# EAGLE design Platine (EAGLE 5.11)
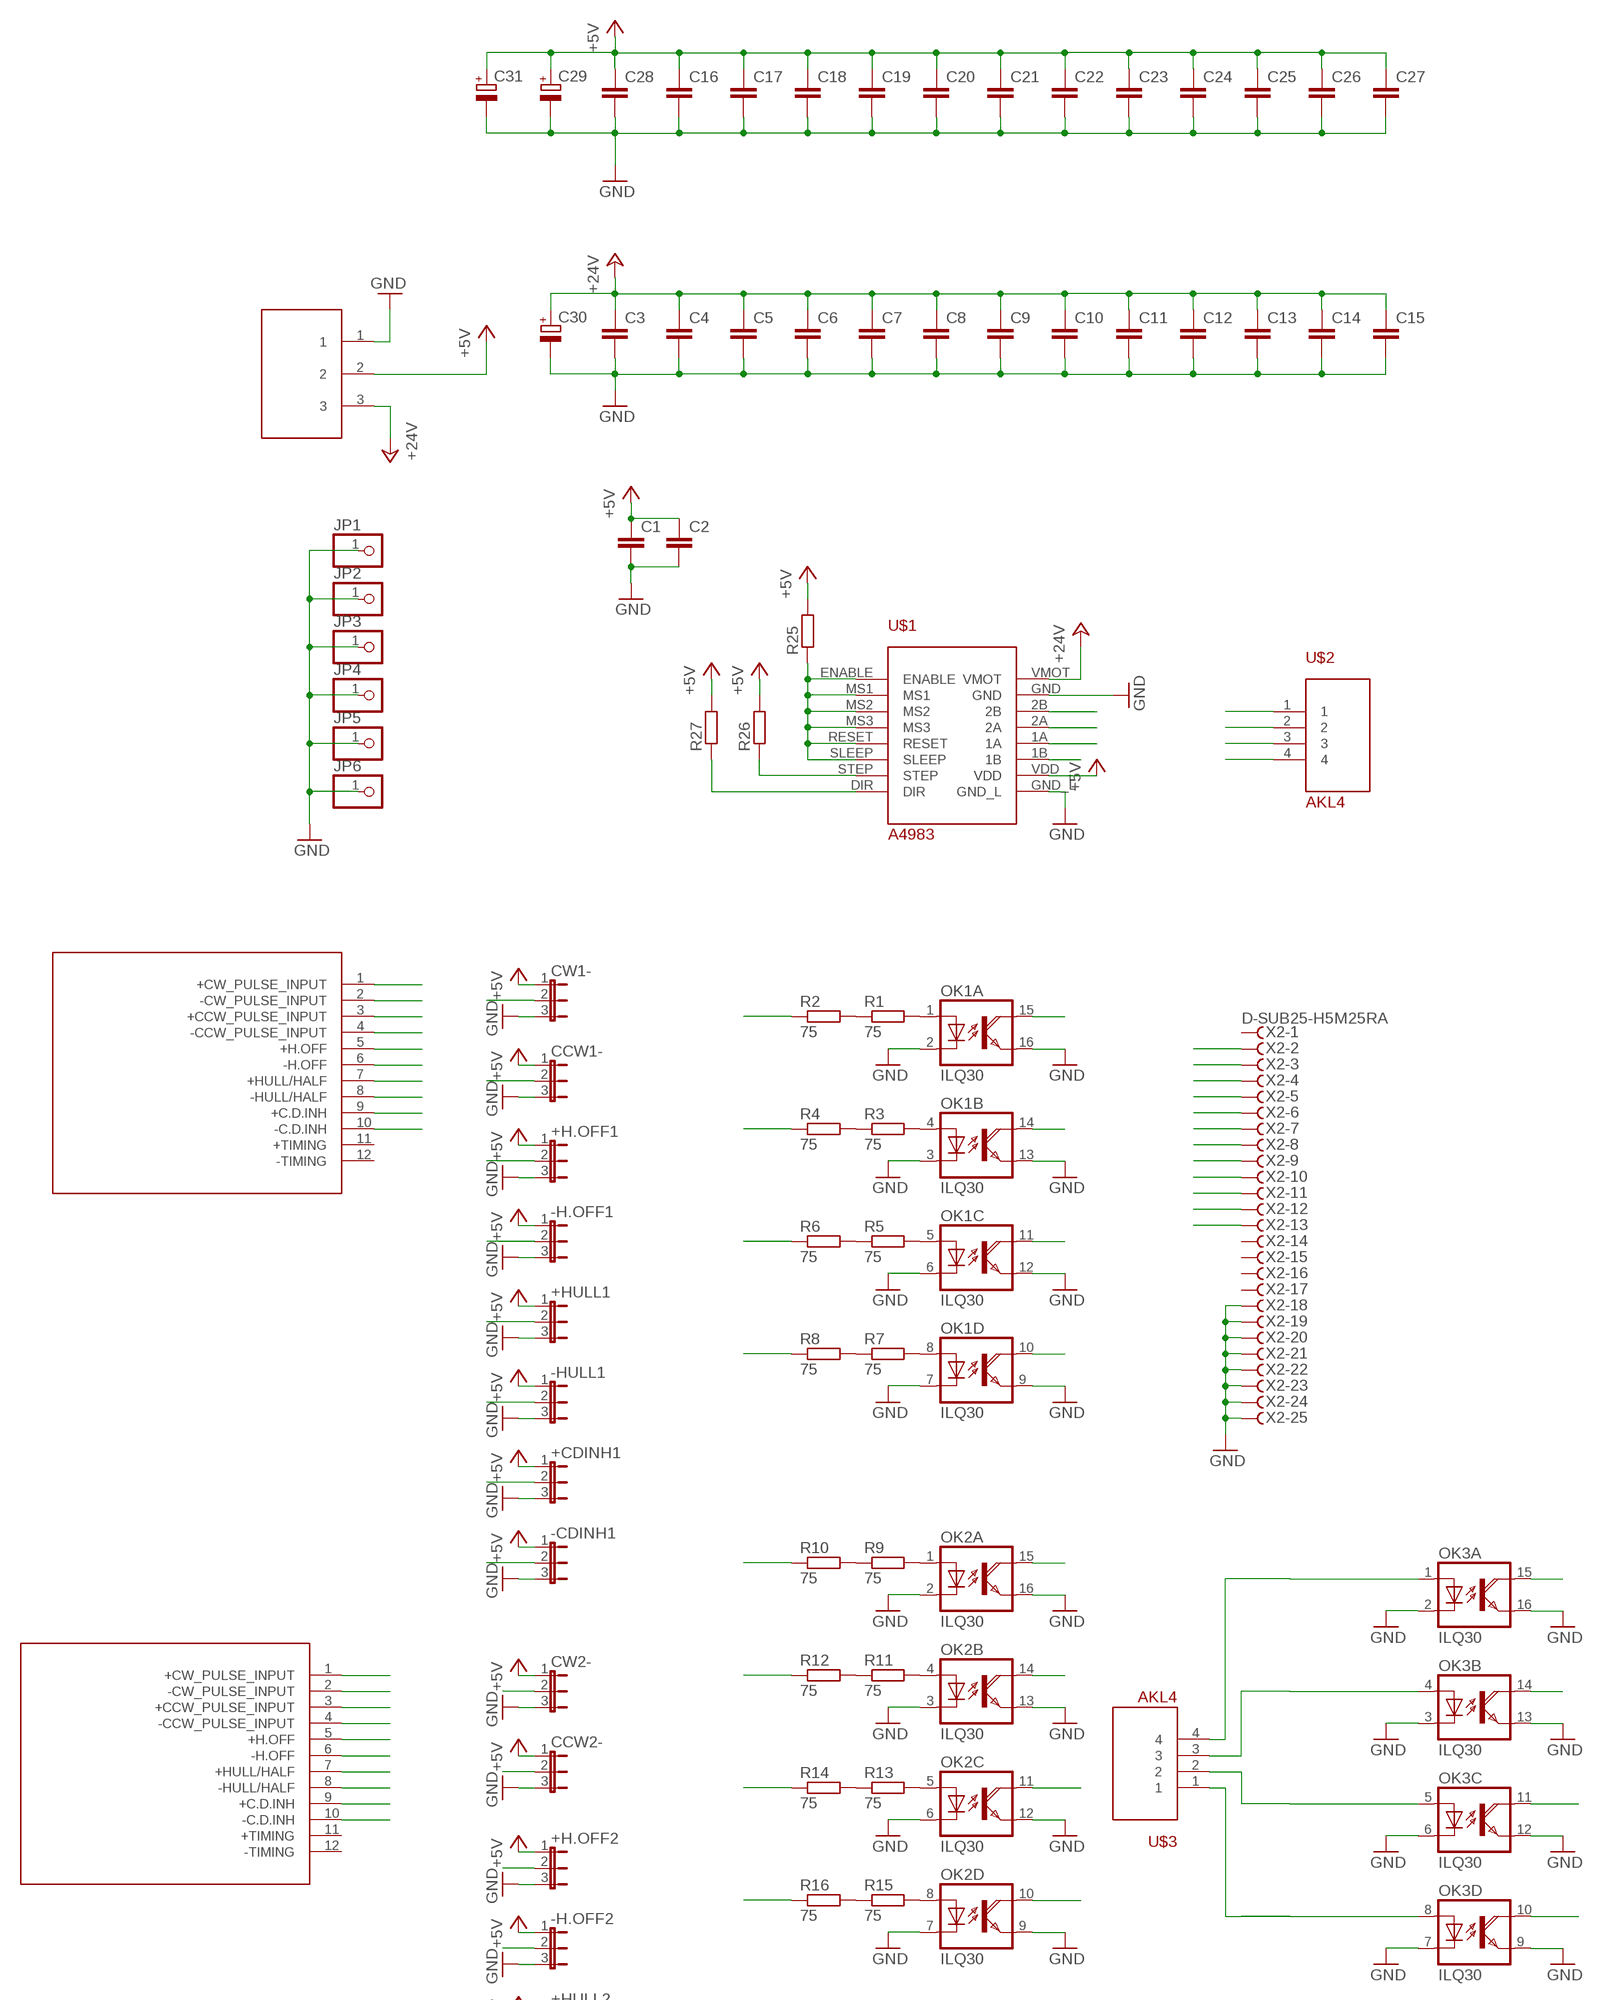
[diagram p0: schematic, sheet 1, part 1 of 2]
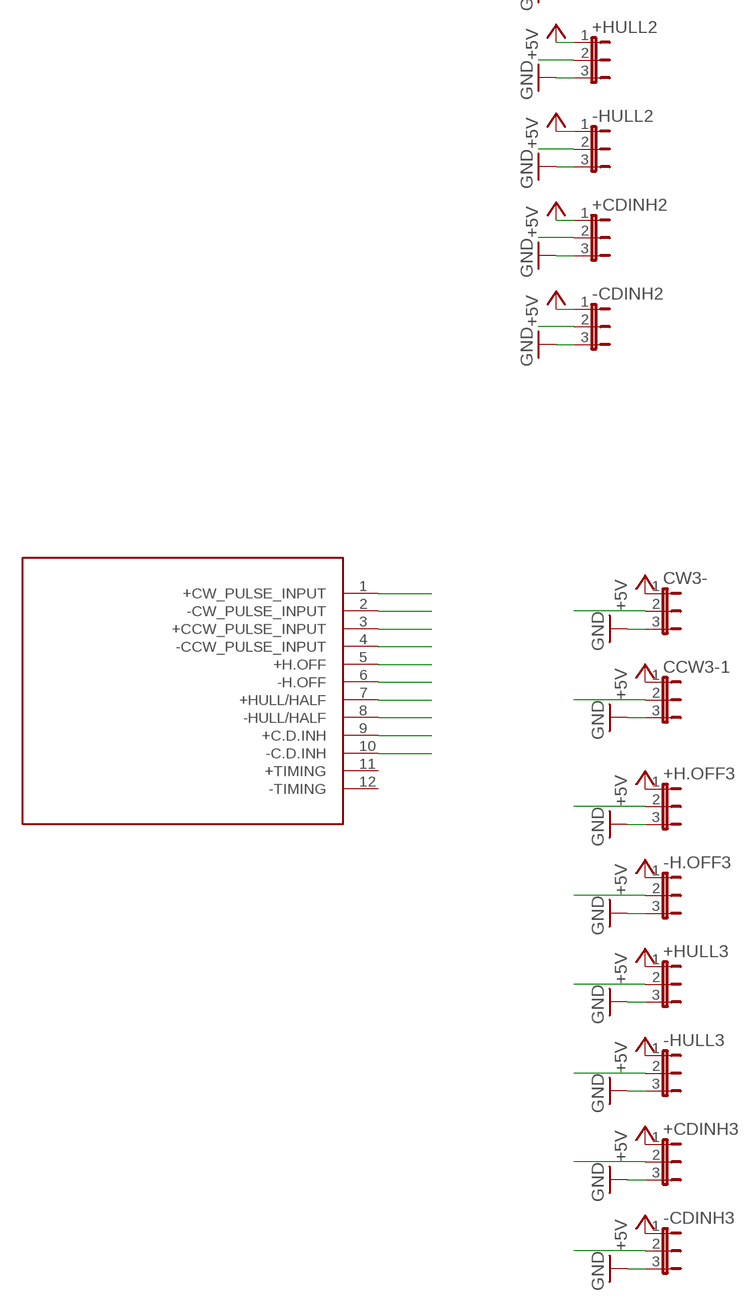
[diagram p1: schematic, sheet 1, part 2 of 2]

## Parts
+CDINH1  JP2E  [JP2]
+CDINH2  JP2E  [JP2]
+CDINH3  JP2E  [JP2]
+H.OFF1  JP2E  [JP2]
+H.OFF2  JP2E  [JP2]
+H.OFF3  JP2E  [JP2]
+HULL1  JP2E  [JP2]
+HULL2  JP2E  [JP2]
+HULL3  JP2E  [JP2]
-CDINH1  JP2E  [JP2]
-CDINH2  JP2E  [JP2]
-CDINH3  JP2E  [JP2]
-H.OFF1  JP2E  [JP2]
-H.OFF2  JP2E  [JP2]
-H.OFF3  JP2E  [JP2]
-HULL1  JP2E  [JP2]
-HULL2  JP2E  [JP2]
-HULL3  JP2E  [JP2]
C1  C-EUC1210  [C1210]
C2  C-EUC1210  [C1210]
C3  C-EUC1210  [C1210]
C4  C-EUC1210  [C1210]
C5  C-EUC1210  [C1210]
C6  C-EUC1210  [C1210]
C7  C-EUC1210  [C1210]
C8  C-EUC1210  [C1210]
C9  C-EUC1210  [C1210]
C10  C-EUC1210  [C1210]
C11  C-EUC1210  [C1210]
C12  C-EUC1210  [C1210]
C13  C-EUC1210  [C1210]
C14  C-EUC1210  [C1210]
C15  C-EUC1210  [C1210]
C16  C-EUC1210  [C1210]
C17  C-EUC1210  [C1210]
C18  C-EUC1210  [C1210]
C19  C-EUC1210  [C1210]
C20  C-EUC1210  [C1210]
C21  C-EUC1210  [C1210]
C22  C-EUC1210  [C1210]
C23  C-EUC1210  [C1210]
C24  C-EUC1210  [C1210]
C25  C-EUC1210  [C1210]
C26  C-EUC1210  [C1210]
C27  C-EUC1210  [C1210]
C28  C-EUC1210  [C1210]
C29  CPOL-EUE5-13  [E5-13]
C30  CPOL-EUE5-13  [E5-13]
C31  CPOL-EUE5-13  [E5-13]
CCW1-  JP2E  [JP2]
CCW2-  JP2E  [JP2]
CCW3-1  JP2E  [JP2]
CW1-  JP2E  [JP2]
CW2-  JP2E  [JP2]
CW3-  JP2E  [JP2]
JP1  PINHD-1X1  [1X01]
JP2  PINHD-1X1  [1X01]
JP3  PINHD-1X1  [1X01]
JP4  PINHD-1X1  [1X01]
JP5  PINHD-1X1  [1X01]
JP6  PINHD-1X1  [1X01]
MOTORTREIBER1  STEPPERCONTROLER  [CONTROLER]
MOTORTREIBER2  STEPPERCONTROLER  [CONTROLER]
MOTORTREIBER3  STEPPERCONTROLER  [CONTROLER]
OK1  ILQ30  [DIL16]
OK2  ILQ30  [DIL16]
OK3  ILQ30  [DIL16]
R1  75  R-EU_MELF0204W  [MINI_MELF-0204W]
R2  75  R-EU_MELF0204W  [MINI_MELF-0204W]
R3  75  R-EU_MELF0204W  [MINI_MELF-0204W]
R4  75  R-EU_MELF0204W  [MINI_MELF-0204W]
R5  75  R-EU_MELF0204W  [MINI_MELF-0204W]
R6  75  R-EU_MELF0204W  [MINI_MELF-0204W]
R7  75  R-EU_MELF0204W  [MINI_MELF-0204W]
R8  75  R-EU_MELF0204W  [MINI_MELF-0204W]
R9  75  R-EU_MELF0204W  [MINI_MELF-0204W]
R10  75  R-EU_MELF0204W  [MINI_MELF-0204W]
R11  75  R-EU_MELF0204W  [MINI_MELF-0204W]
R12  75  R-EU_MELF0204W  [MINI_MELF-0204W]
R13  75  R-EU_MELF0204W  [MINI_MELF-0204W]
R14  75  R-EU_MELF0204W  [MINI_MELF-0204W]
R15  75  R-EU_MELF0204W  [MINI_MELF-0204W]
R16  75  R-EU_MELF0204W  [MINI_MELF-0204W]
R25  R-EU_R0805  [R0805]
R26  R-EU_R0805  [R0805]
R27  R-EU_R0805  [R0805]
U$1  A4983  [A4983]
U$2  AKL4  AKL45.08  [AKL5.08]
U$3  AKL4  AKL45.08  [AKL5.08]
U$4  AKL35.08  [AKL3-5.08]
X2  D-SUB25-H5M25RA  [H5M25RA]

## Nets
+5V: +CDINH1.1 +CDINH2.1 +CDINH3.1 +H.OFF1.1 +H.OFF2.1 +H.OFF3.1 +HULL1.1 +HULL2.1 +HULL3.1 -CDINH1.1 -CDINH2.1 -CDINH3.1 -H.OFF1.1 -H.OFF2.1 -H.OFF3.1 -HULL1.1 -HULL2.1 -HULL3.1 C1.1 C2.1 C16.1 C17.1 C18.1 C19.1 C20.1 C21.1 C22.1 C23.1 C24.1 C25.1 C26.1 C27.1 C28.1 C29.+ C31.+ CCW1-.1 CCW2-.1 CCW3-1.1 CW1-.1 CW2-.1 CW3-.1 R25.2 R26.2 R27.2 U$1.VDD U$4.2
+24V: C3.1 C4.1 C5.1 C6.1 C7.1 C8.1 C9.1 C10.1 C11.1 C12.1 C13.1 C14.1 C15.1 C30.+ U$1.VMOT U$4.3
+CDINH1: +CDINH1.2 MOTORTREIBER1.9(+C.D.INH)
+CDINH2: +CDINH2.2 MOTORTREIBER2.9(+C.D.INH)
+CDINH3: +CDINH3.2 MOTORTREIBER3.9(+C.D.INH)
+H.OFF1: +H.OFF1.2 MOTORTREIBER1.5(+H.OFF)
+H.OFF2: +H.OFF2.2 MOTORTREIBER2.5(+H.OFF)
+H.OFF3: +H.OFF3.2 MOTORTREIBER3.5(+H.OFF)
+HULL1: +HULL1.2 MOTORTREIBER1.7(+HULL/HALF)
+HULL2: +HULL2.2 MOTORTREIBER2.7(+HULL/HALF)
+HULL3: +HULL3.2 MOTORTREIBER3.7(+HULL/HALF)
-CDINH1: -CDINH1.2 MOTORTREIBER1.10(-C.D.INH)
-CDINH2: -CDINH2.2 MOTORTREIBER2.10(-C.D.INH)
-CDINH3: -CDINH3.2 MOTORTREIBER3.10(-C.D.INH)
-H.OFF1: -H.OFF1.2 MOTORTREIBER1.6(-H.OFF)
-H.OFF2: -H.OFF2.2 MOTORTREIBER2.6(-H.OFF)
-H.OFF3: -H.OFF3.2 MOTORTREIBER3.6(-H.OFF)
-HULL1: -HULL1.2 MOTORTREIBER1.8(-HULL/HALF)
-HULL2: -HULL2.2 MOTORTREIBER2.8(-HULL/HALF)
-HULL3: -HULL3.2 MOTORTREIBER3.8(-HULL/HALF)
CCW1: MOTORTREIBER1.3(+CCW_PULSE_INPUT) OK1.11(C:COL)
CCW1-: CCW1-.2 MOTORTREIBER1.4(-CCW_PULSE_INPUT)
CCW2: MOTORTREIBER2.3(+CCW_PULSE_INPUT) OK1.15(A:COL)
CCW2-: CCW2-.2 MOTORTREIBER2.4(-CCW_PULSE_INPUT)
CCW3: MOTORTREIBER3.3(+CCW_PULSE_INPUT) OK2.11(C:COL)
CCW3-: CCW3-1.2 MOTORTREIBER3.4(-CCW_PULSE_INPUT)
CW1: MOTORTREIBER1.1(+CW_PULSE_INPUT) OK1.10(D:COL)
CW1-: CW1-.2 MOTORTREIBER1.2(-CW_PULSE_INPUT)
CW2: MOTORTREIBER2.1(+CW_PULSE_INPUT) OK1.14(B:COL)
CW2-: CW2-.2 MOTORTREIBER2.2(-CW_PULSE_INPUT)
CW3: MOTORTREIBER3.1(+CW_PULSE_INPUT) OK2.10(D:COL)
CW3-: CW3-.2 MOTORTREIBER3.2(-CW_PULSE_INPUT)
DIR: OK2.14(B:COL) R27.1 U$1.DIR
GNDLAPTOP: OK1.2(A:C) OK1.3(B:C) OK1.6(C:C) OK1.7(D:C) OK2.2(A:C) OK2.3(B:C) OK2.6(C:C) OK2.7(D:C) OK3.9(D:EMI) OK3.12(C:EMI) OK3.13(B:EMI) OK3.16(A:EMI) X2.18 X2.19 X2.20 X2.21 X2.22 X2.23 X2.24 X2.25 ; supply symbol labelled GND
GNDROBOTER: +CDINH1.3 +CDINH2.3 +CDINH3.3 +H.OFF1.3 +H.OFF2.3 +H.OFF3.3 +HULL1.3 +HULL2.3 +HULL3.3 -CDINH1.3 -CDINH2.3 -CDINH3.3 -H.OFF1.3 -H.OFF2.3 -H.OFF3.3 -HULL1.3 -HULL2.3 -HULL3.3 C1.2 C2.2 C3.2 C4.2 C5.2 C6.2 C7.2 C8.2 C9.2 C10.2 C11.2 C12.2 C13.2 C14.2 C15.2 C16.2 C17.2 C18.2 C19.2 C20.2 C21.2 C22.2 C23.2 C24.2 C25.2 C26.2 C27.2 C28.2 C29.- C30.- C31.- CCW1-.3 CCW2-.3 CCW3-1.3 CW1-.3 CW2-.3 CW3-.3 JP1.1 JP2.1 JP3.1 JP4.1 JP5.1 JP6.1 OK1.9(D:EMI) OK1.12(C:EMI) OK1.13(B:EMI) OK1.16(A:EMI) OK2.9(D:EMI) OK2.12(C:EMI) OK2.13(B:EMI) OK2.16(A:EMI) OK3.2(A:C) OK3.3(B:C) OK3.6(C:C) OK3.7(D:C) U$1.GND U$1.GND_L U$4.1 ; supply symbol labelled GND
IN1: OK3.1(A:A) U$3.4
IN2: OK3.4(B:A) U$3.3
IN3: OK3.5(C:A) U$3.2
INL1: OK3.15(A:COL) X2.13
INL2: OK3.14(B:COL) X2.12
INL3: OK3.11(C:COL) X2.11
INL4: OK3.10(D:COL) X2.10
MOTOR1A: U$1.1A U$2.3
MOTOR1B: U$1.1B U$2.4
MOTOR2A: U$1.2A U$2.2
MOTOR2B: U$1.2B U$2.1
N$1: OK1.1(A:A) R1.2
N$2: R3.1 R4.2
N$3: OK1.4(B:A) R3.2
N$4: R5.1 R6.2
N$5: R1.1 R2.2
N$6: OK1.5(C:A) R5.2
N$7: OK1.8(D:A) R7.2
N$8: R7.1 R8.2
N$9: OK2.1(A:A) R9.2
N$10: R9.1 R10.2
N$11: R11.1 R12.2
N$12: R13.1 R14.2
N$13: R15.1 R16.2
N$14: OK2.4(B:A) R11.2
N$15: OK2.5(C:A) R13.2
N$16: OK2.8(D:A) R15.2
N$18: OK3.8(D:A) U$3.1
N$25: R25.1 U$1.ENABLE U$1.MS1 U$1.MS2 U$1.MS3 U$1.RESET U$1.SLEEP
OUT1: R2.1 X2.2
OUT2: R4.1 X2.3
OUT3: R6.1 X2.4
OUT4: R8.1 X2.5
OUT5: R10.1 X2.6
OUT6: R12.1 X2.7
OUT7: R14.1 X2.8
OUT8: R16.1 X2.9
STEP: OK2.15(A:COL) R26.1 U$1.STEP
Unconnected: MOTORTREIBER1.11(+TIMING) MOTORTREIBER1.12(-TIMING) MOTORTREIBER2.11(+TIMING) MOTORTREIBER2.12(-TIMING) MOTORTREIBER3.11(+TIMING) MOTORTREIBER3.12(-TIMING) X2.1 X2.14 X2.15 X2.16 X2.17

## Library data of the parts
+CDINH1-+CDINH3 +H.OFF1-+H.OFF3 +HULL1-+HULL3 -CDINH1--CDINH3 -H.OFF1--H.OFF3 -HULL1--HULL3 CCW1- CCW2- CCW3-1 CW1- CW2- CW3- = jumper:JP2E: JUMPER
C1-C28 = rcl:C-EU: CAPACITOR, European symbol
C29-C31 = rcl:CPOL-EU: POLARIZED CAPACITOR, European symbol
JP1-JP6 = pinhead:PINHD-1X1: PIN HEADER
MOTORTREIBER1-MOTORTREIBER3 = steppercontroler C5D5814N-P:STEPPERCONTROLER
OK1-OK3 = optocoupler:ILQ30: SIEMENS OPTO COUPLER; MF: VISHAY/TELEFUNKEN; MPN: ILQ30; OC_FARNELL: 1612449; OC_NEWARK: 58K1688
R1-R16 R25-R27 = rcl:R-EU_: RESISTOR, European symbol
U$1 = A4983:A4983
U$2 U$3 = anschlussklemmen:AKL4
U$4 = anschlussklemmen:AKL3
X2 = con-thomas-betts-smallholes:D-SUB25-: D-Subminiatur Connector Source: Electronioc Interconnects European Edition 1998; MPN: H5M25RA29CS; OC_FARNELL: unknown; OC_NEWARK: 93F8324

## Board
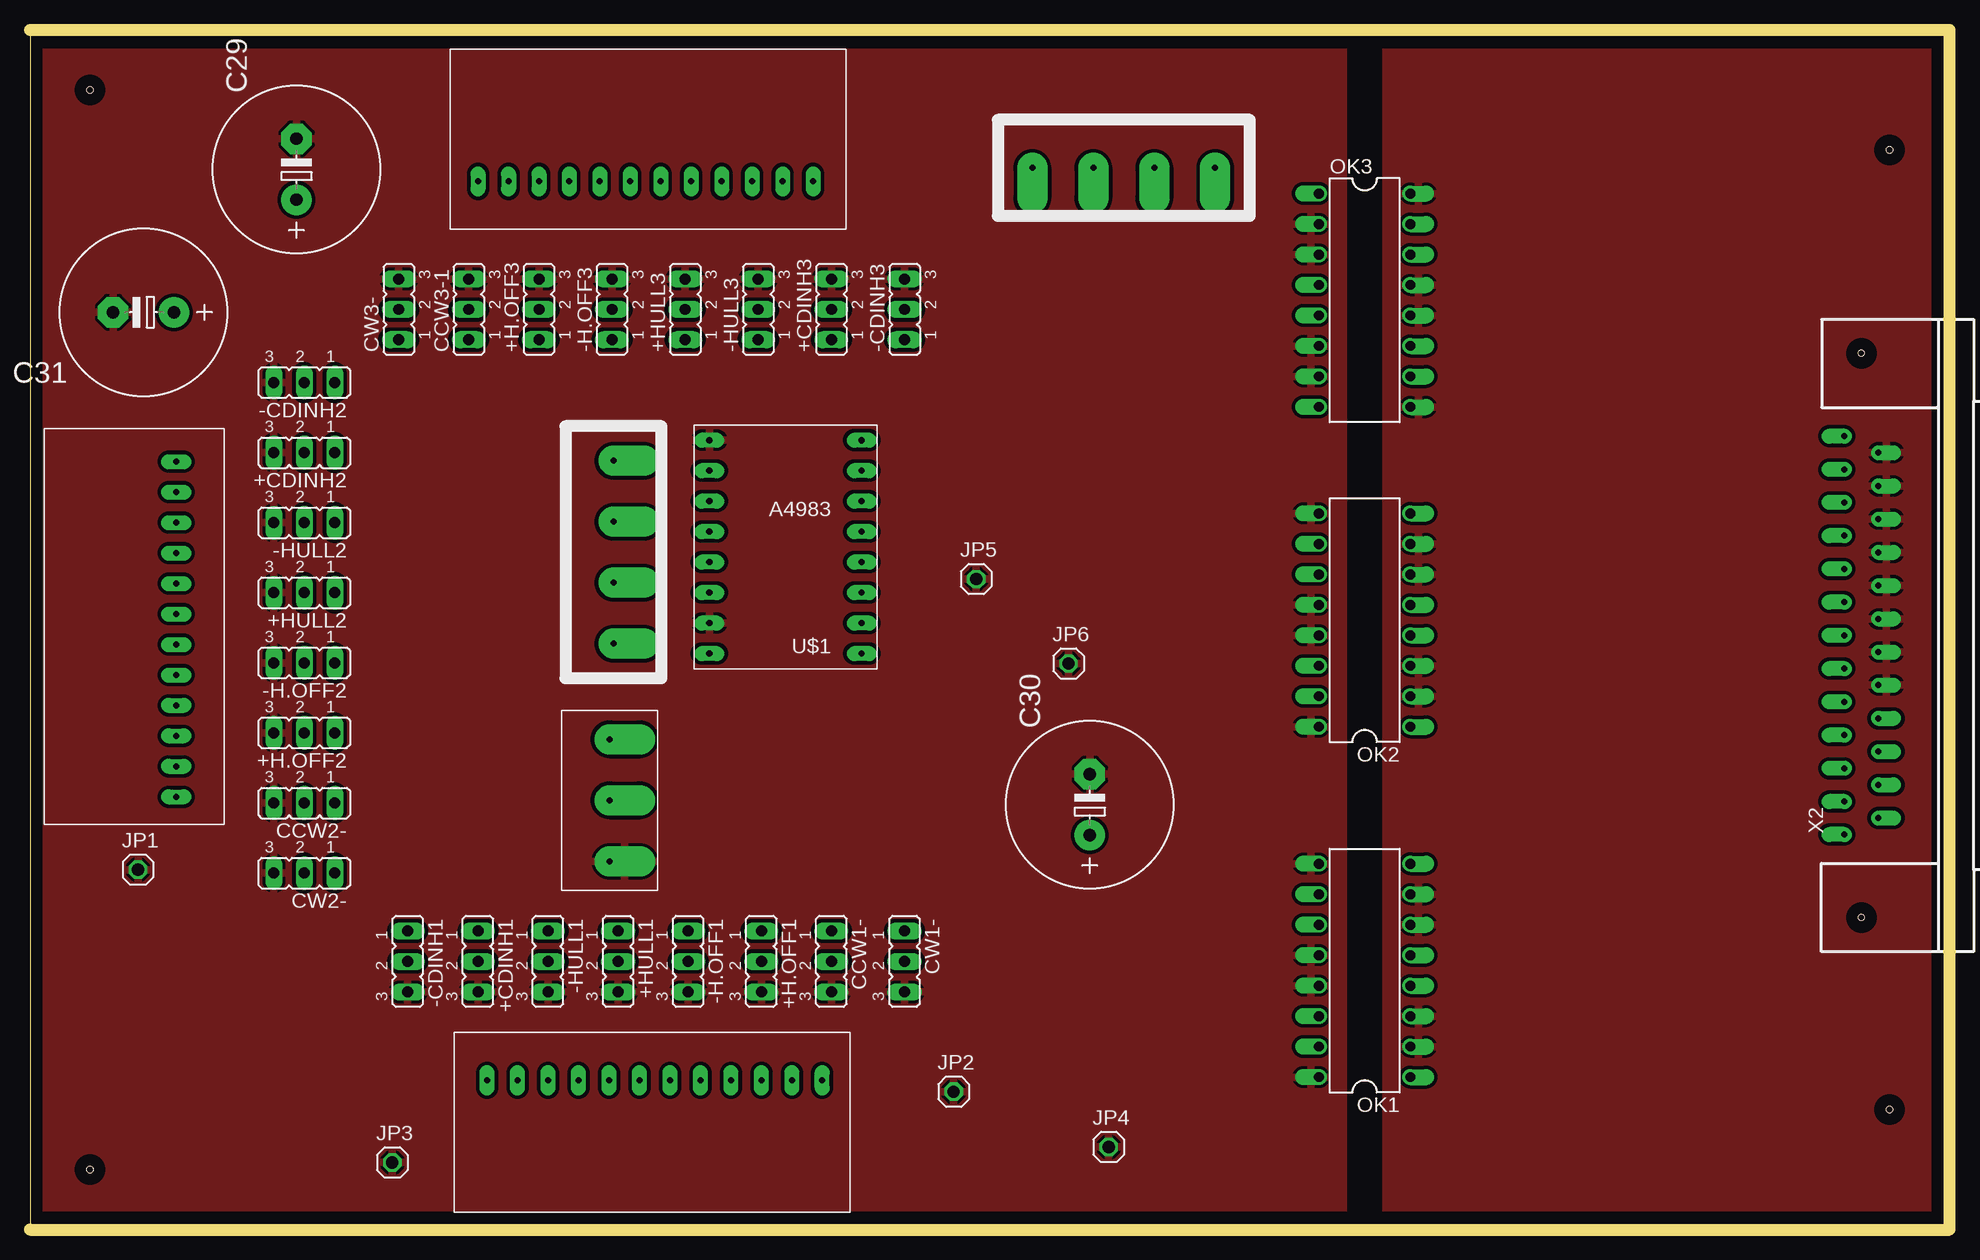
[diagram p2: board, top side]
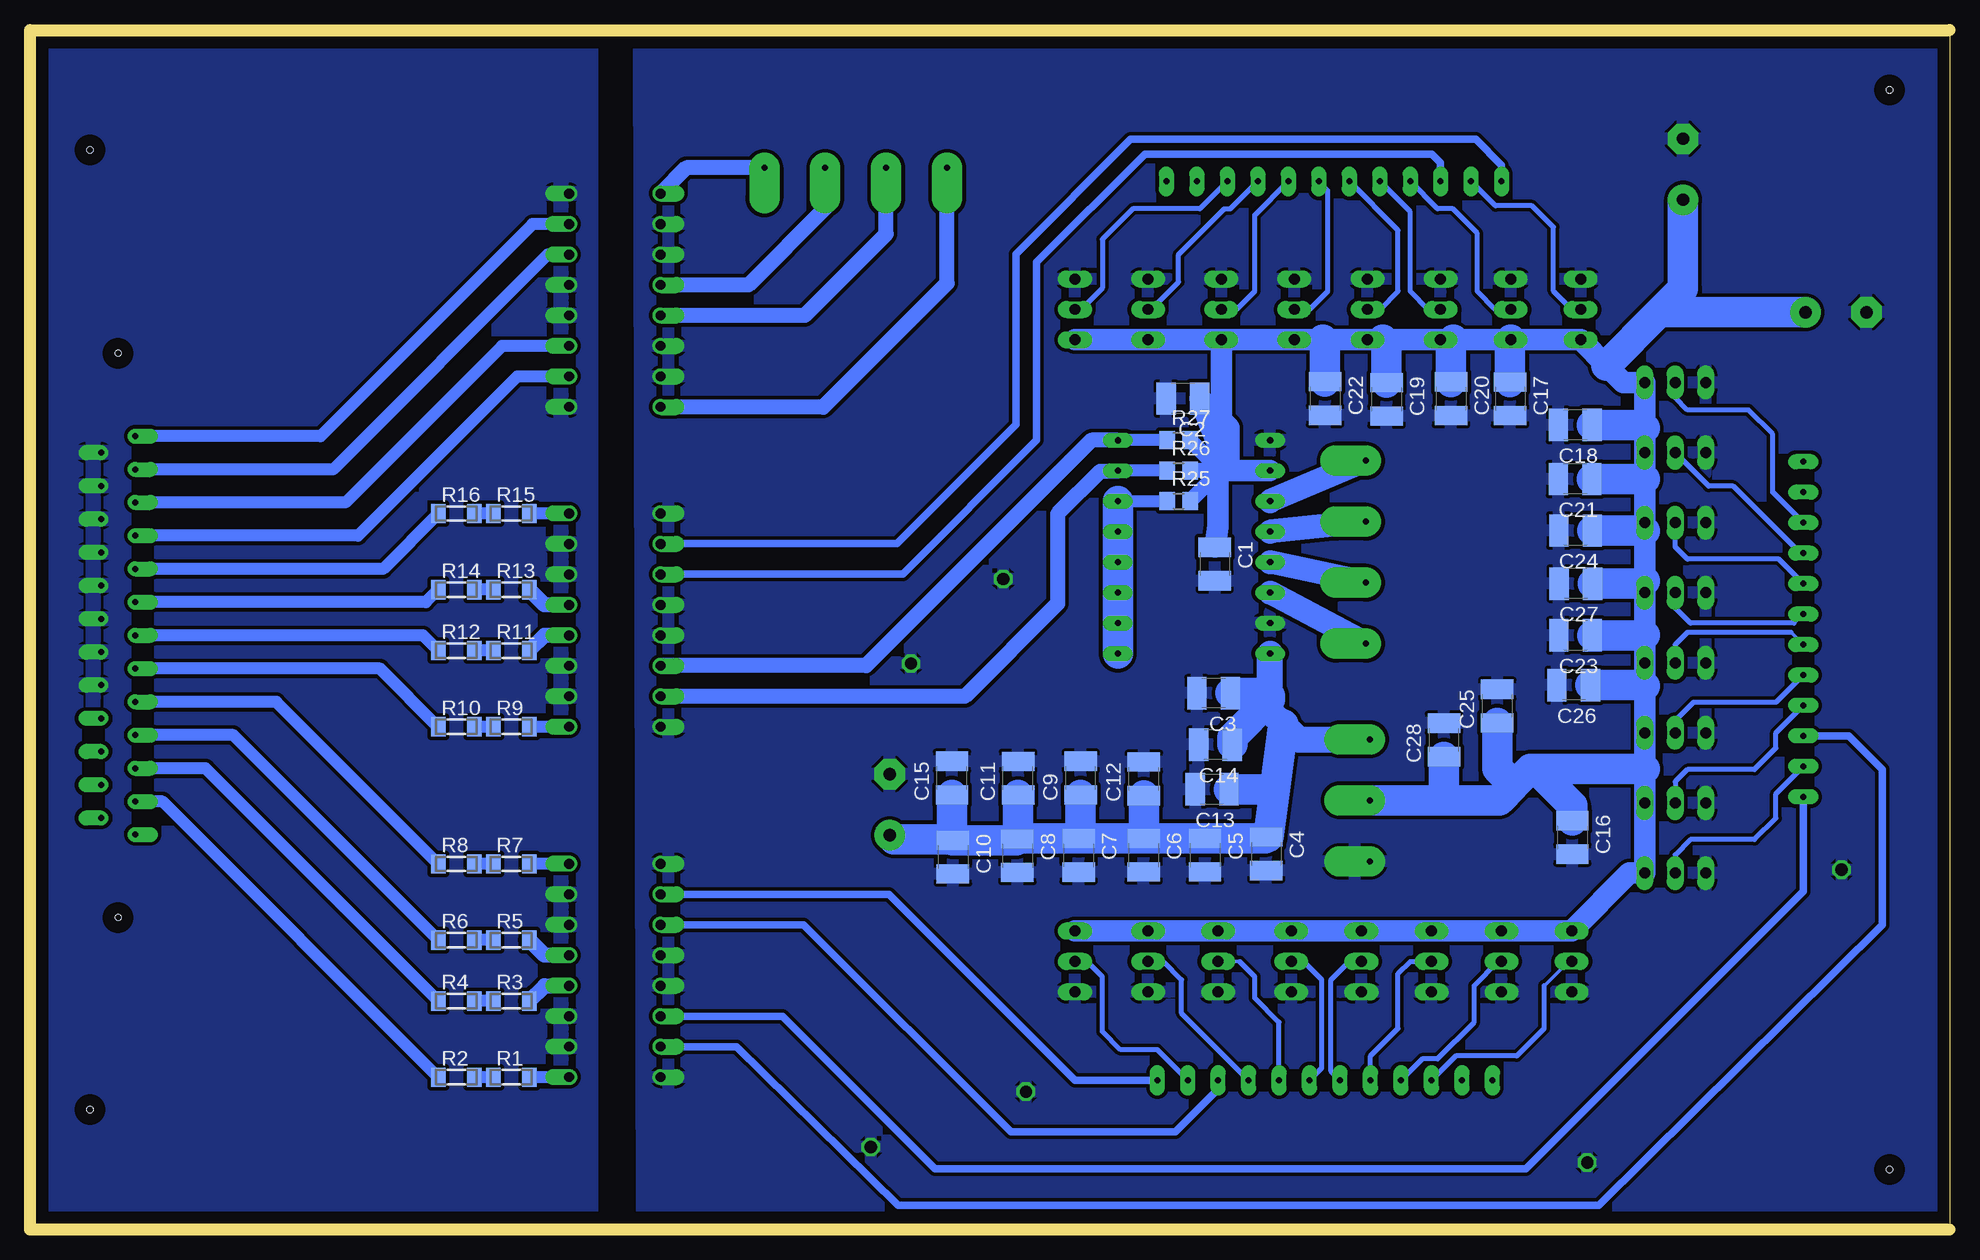
[diagram p3: board, bottom side, seen from below]

Size 160 x 100 mm. Coordinates in mm from the lower left corner, seen from the top.
Outline: 0,0 160,0 160,100 0,100 0,0
Copper layers (1*16): Top 0.035mm / dielectric 1.5mm / Bottom 0.035mm
Design rules "default *": minimum track width 10mil, minimum drill 1mil, track to track 12mil, track to pad 12mil, pad to pad 12mil, via to via 12mil, smd to smd 12mil, copper to edge 40mil, drill to drill 8mil, minimum pad ring 10mil, minimum via ring 8mil, stop-mask expansion 4mil, vias tented up to drill 0mil, thermal gap 10mil
Holes 0.5 mm at 5,5 5,95 155,10 155,90

### Footprints (pad centres in the part's own frame; a part is rotated, then mirrored left to right if it is on the bottom)
JP2 = drill 0.914 long: 1 -2.54,0; 2 0,0; 3 2.54,0
C1210 = smd 1.6 x 2.7: 1 -1.4,0; 2 1.4,0
E5-13 = drill 1.016 pad 2.54 round: + -2.54,0 | drill 1.016 pad 2.54 octagon: - 2.54,0
1X01 = drill 1.016 octagon: 1 0,0
CONTROLER = drill 0.5 pad 1.27 long: 1 0,12.7; 2 0,10.16; 3 0,7.62; 4 0,5.08; 5 0,2.54; 6 0,0; 7 0,-2.54; 8 0,-5.08; 9 0,-7.62; 10 0,-10.16; 11 0,-12.7; 12 0,-15.24
DIL16 = drill 0.813 offset: 1 -8.89,-3.81; 2 -6.35,-3.81; 3 -3.81,-3.81; 4 -1.27,-3.81; 5 1.27,-3.81; 6 3.81,-3.81; 7 6.35,-3.81; 8 8.89,-3.81; 9 8.89,3.81; 10 6.35,3.81; 11 3.81,3.81; 12 1.27,3.81; 13 -1.27,3.81; 14 -3.81,3.81; 15 -6.35,3.81; 16 -8.89,3.81
MINI_MELF-0204W = smd 1.2 x 1.6: 1 -1.5,0; 2 1.5,0
R0805 = smd 1.3 x 1.5: 1 -0.95,0; 2 0.95,0
A4983 = drill 0.508 pad 1.27 long: 1A 7.62,-2.54; 1B 7.62,-5.08; 2A 7.62,0; 2B 7.62,2.54; DIR -5.08,-10.16; ENABLE -5.08,7.62; GND 7.62,5.08; GND_L 7.62,-10.16; MS1 -5.08,5.08; MS2 -5.08,2.54; MS3 -5.08,0; RESET -5.08,-2.54; SLEEP -5.08,-5.08; STEP -5.08,-7.62; VDD 7.62,-7.62; VMOT 7.62,7.62
AKL5.08 = drill 0.5 pad 2.54 offset: 1 7.62,0; 2 2.54,0; 3 -2.54,0; 4 -7.62,0
AKL3-5.08 = drill 0.5 pad 2.54 offset: 1 5.08,0; 2 0,0; 3 -5.08,0
H5M25RA = drill 0.5 pad 1.27 offset: 1 -16.612,1.422; 2 -13.843,1.422; 3 -11.074,1.422; 4 -8.306,1.422; 5 -5.537,1.422; 6 -2.769,1.422; 7 0,1.422; 8 2.769,1.422; 9 5.537,1.422; 10 8.306,1.422; 11 11.074,1.422; 12 13.843,1.422; 13 16.612,1.422; 14 -15.227,-1.422; 15 -12.459,-1.422; 16 -9.69,-1.422; 17 -6.921,-1.422; 18 -4.153,-1.422; 19 -1.384,-1.422; 20 1.384,-1.422; 21 4.153,-1.422; 22 6.921,-1.422; 23 9.69,-1.422; 24 12.459,-1.422; 25 15.227,-1.422 | hole 0.5: -23.52,0; 23.52,0

### Placement (x,y rotation side)
+CDINH1  37.34,22.35 270 top
+CDINH2  22.86,64.77 180 top
+CDINH3  66.8,76.71 90 top
+H.OFF1  60.96,22.35 270 top
+H.OFF2  22.86,41.4 180 top
+H.OFF3  42.42,76.71 90 top
+HULL1  49.02,22.35 270 top
+HULL2  22.86,53.09 180 top
+HULL3  54.61,76.71 90 top
-CDINH1  31.5,22.35 270 top
-CDINH2  22.86,70.61 180 top
-CDINH3  72.9,76.71 90 top
-H.OFF1  54.86,22.35 270 top
-H.OFF2  22.86,47.24 180 top
-H.OFF3  48.51,76.71 90 top
-HULL1  43.18,22.35 270 top
-HULL2  22.86,58.93 180 top
-HULL3  60.71,76.71 90 top
C1  61.25,55.48 270 bottom
C2  63.89,69.27 180 bottom
C3  61.33,44.71 180 bottom
C4  56.96,31.32 270 bottom
C5  62.06,31.21 270 bottom
C6  67.18,31.21 270 bottom
C7  72.6,31.2 270 bottom
C8  77.7,31.16 270 bottom
C9  72.42,37.64 90 bottom
C10  83.07,31.05 270 bottom
C11  77.64,37.62 90 bottom
C12  67.16,37.57 90 bottom
C13  61.47,36.7 180 bottom
C14  61.19,40.42 180 bottom
C15  83.15,37.64 90 bottom
C16  31.44,32.69 270 bottom
C17  36.63,69.25 270 bottom
C18  31.2,67.07 180 bottom
C19  46.93,69.21 270 bottom
C20  41.55,69.26 270 bottom
C21  31.21,62.56 180 bottom
C22  52.05,69.28 270 bottom
C23  31.17,49.53 180 bottom
C24  31.17,58.27 180 bottom
C25  37.7,43.64 90 bottom
C26  31.32,45.38 180 bottom
C27  31.15,53.85 180 bottom
C28  42.13,40.81 90 bottom
C29  22.21,88.39 90 top
C30  88.34,35.42 90 top
C31  9.46,76.46 180 top
CCW1-  66.8,22.35 270 top
CCW2-  22.86,35.56 180 top
CCW3-1  36.58,76.71 90 top
CW1-  72.9,22.35 270 top
CW2-  22.86,29.72 180 top
CW3-  30.73,76.71 90 top
JP1  9,30 0 top
JP2  76.99,11.49 0 top
JP3  30.2,5.59 0 top
JP4  89.91,6.88 0 top
JP5  78.87,54.23 0 top
JP6  86.57,47.18 0 top
MOTORTREIBER1  53.34,12.45 270 top
MOTORTREIBER2  12.19,48.77 180 top
MOTORTREIBER3  50.04,87.38 90 top
OK1  111.25,21.59 90 top
OK2  111.25,50.8 90 top
OK3  111.25,77.47 270 top
R1  119.89,12.7 0 bottom
R2  124.46,12.7 0 bottom
R3  119.89,19.05 0 bottom
R4  124.46,19.05 0 bottom
R5  119.89,24.13 0 bottom
R6  124.46,24.13 0 bottom
R7  119.89,30.48 0 bottom
R8  124.46,30.48 0 bottom
R9  119.89,41.91 0 bottom
R10  124.46,41.91 0 bottom
R11  119.89,48.26 0 bottom
R12  124.46,48.26 0 bottom
R13  119.89,53.34 0 bottom
R14  124.46,53.34 0 bottom
R15  119.89,59.69 0 bottom
R16  124.46,59.69 0 bottom
R25  64.25,60.71 0 bottom
R26  64.25,63.25 0 bottom
R27  64.25,65.79 0 bottom
U$1  64.25,55.63 180 top
U$2  48.64,56.47 270 top
U$3  91.17,88.51 180 top
U$4  48.3,35.78 270 top
X2  152.65,49.53 90 top

### Tracks (layer width: path | path; a pad name or v marks a point on that pad's centre or on a via)
+5V
  Bottom 0.61: 60.97,63.05 60.76,63.25 60.08,63.25
  Bottom 1.27: R26.2 60.76,63.25 R27.2 | 60.97,63.05 R25.2
  Bottom 1.778: CW1-.1 CCW1-.1 +H.OFF1.1 -H.OFF1.1 +HULL1.1 -HULL1.1 +CDINH1.1 -CDINH1.1 26.67,29.72 CW2-.1 CCW2-.1 25.4,38.4 +H.OFF2.1 25.4,45.31 -H.OFF2.1 25.4,49.57 +HULL2.1 25.4,54.07 25.4,58.24 -HULL2.1 25.4,62.57 +CDINH2.1 25.4,66.81 -CDINH2.1 27.18,70.61 28.6,72.03 CW3-.1 CCW3-1.1 41.36,74.17 +H.OFF3.1 47.25,74.17 -H.OFF3.1 52.22,74.17 +HULL3.1 -HULL3.1 | -CDINH3.1 +CDINH3.1 -HULL3.1 | U$1.VDD 60.08,63.25 60.08,66.86 C2.1 60.71,64.64 -HULL3.1 | C1.1 60.97,58.61 60.97,63.05
  Bottom 2.54: 42.35,35.78 37.54,35.78 36.3,37.02 | 42.35,35.78 U$4.2 | 36.3,37.02 34.92,38.4 34.49,38.4 | 25.4,38.4 34.49,38.4 | C26.1 25.47,45.38 25.4,45.31 | C23.1 25.44,49.53 25.4,49.57 | C27.1 25.62,53.85 25.4,54.07 | C21.1 25.41,62.56 25.4,62.57 | C24.1 25.43,58.27 25.4,58.24 | C18.1 25.66,67.07 25.4,66.81 | C17.1 36.63,74.11 CCW3-1.1 | C20.1 41.55,73.98 41.36,74.17 | C19.1 46.93,73.85 47.25,74.17 | C22.1 52.05,74 52.22,74.17 | C28.1 42.13,36 42.35,35.78 | C25.1 37.7,38.43 36.3,37.02 | C16.1 31.44,35.35 34.49,38.4 | 24.17,76.46 C31.+ | 28.6,72.03 24.17,76.46 | C29.+ 22.21,78.42 24.17,76.46
+24V
  Bottom 2.184: U$1.VMOT 56.63,44.48 56.63,44.19 56.63,43.2 55.53,42.1 54.27,40.84 48.32,40.84 U$4.3
  Bottom 2.54: C3.1 56.86,44.71 56.63,44.48 | 56.2,37.04 56.76,32.72 C4.1 57.07,32.61 C5.1 C6.1 | 56.2,37.04 55.53,42.1 | C6.1 C7.1 | C7.1 77.66,32.6 C8.1 | C8.1 77.81,32.45 C10.1 83.15,32.53 | C13.1 56.54,36.7 56.2,37.04 | C14.1 59.79,41.03 56.63,44.19 | C12.1 67.16,32.63 C6.1 | C9.1 72.42,32.78 C7.1 | C11.1 77.64,32.62 C8.1 | 83.15,32.53 C15.1 | 83.15,32.53 87.99,32.53 C30.+
+CDINH1
  Bottom 0.305: 37.59,22.35 +CDINH1.2
  Bottom 0.406: 37.59,22.35 39.62,20.32 39.62,17.27 42.67,14.22 43.94,14.22 MOTORTREIBER1.9
+CDINH2
  Bottom 0.305: MOTORTREIBER2.9 12.45,56.39
  Bottom 0.406: 12.45,56.39 18.03,61.98 20.07,61.98 +CDINH2.2
+CDINH3
  Bottom 0.406: +CDINH3.2 66.55,76.71 64.26,78.99 64.26,81.28 60.45,85.09 59.94,85.09 MOTORTREIBER3.9
+H.OFF1
  Bottom 0.305: 59.18,22.35 +H.OFF1.2
  Bottom 0.406: 59.18,22.35 57.91,21.08 57.91,19.3 55.88,17.27 MOTORTREIBER1.5
+H.OFF2
  Bottom 0.406: +H.OFF2.2 22.86,42.42 21.34,43.94 14.48,43.94 MOTORTREIBER2.5
+H.OFF3
  Bottom 0.406: +H.OFF3.2 43.43,76.71 44.96,78.23 44.96,84.84 MOTORTREIBER3.5
+HULL1
  Bottom 0.305: 50.04,22.35 +HULL1.2
  Bottom 0.406: 50.04,22.35 51.56,20.83 51.56,13.21 MOTORTREIBER1.7
+HULL2
  Bottom 0.305: MOTORTREIBER2.7 12.95,50.55
  Bottom 0.406: +HULL2.2 22.86,51.82 21.59,50.55 12.95,50.55
+HULL3
  Bottom 0.406: +HULL3.2 53.34,76.71 51.82,78.23 51.82,86.61 MOTORTREIBER3.7
-CDINH1
  Bottom 0.305: -CDINH1.2 31.75,22.35 33.78,20.32
  Bottom 0.406: 33.78,20.32 33.78,16.76 36.07,14.48 41.15,14.48 MOTORTREIBER1.10
-CDINH2
  Bottom 0.406: -CDINH2.2 22.86,69.34 21.84,68.33 16.76,68.33 14.73,66.29 14.73,61.47 MOTORTREIBER2.10
-CDINH3
  Bottom 0.406: -CDINH3.2 72.39,76.71 70.61,78.49 70.61,82.55 68.07,85.09 62.48,85.09 MOTORTREIBER3.10
-H.OFF1
  Bottom 0.305: 53.85,22.35 -H.OFF1.2
  Bottom 0.406: 53.85,22.35 52.32,20.83 52.32,13.46 MOTORTREIBER1.6
-H.OFF2
  Bottom 0.305: MOTORTREIBER2.6 13.21,49.78
  Bottom 0.406: -H.OFF2.2 22.86,48.77 21.84,49.78 13.21,49.78
-H.OFF3
  Bottom 0.406: -H.OFF3.2 47.5,76.71 45.97,78.23 45.97,83.31 MOTORTREIBER3.6
-HULL1
  Bottom 0.406: -HULL1.2 44.96,22.35 45.97,21.34 45.97,16.76 48.26,14.48 MOTORTREIBER1.8
-HULL2
  Bottom 0.406: -HULL2.2 22.86,56.9 21.84,55.88 14.22,55.88 MOTORTREIBER2.8
-HULL3
  Bottom 0.406: -HULL3.2 59.44,76.71 57.91,78.23 57.91,84.58 MOTORTREIBER3.8
CCW1
  Bottom 0.61: MOTORTREIBER1.3 60.96,11.68 64.52,8.13 78.23,8.13 95.5,25.4 OK1.11
CCW1-
  Bottom 0.305: 65.53,22.35 CCW1-.2
  Bottom 0.406: 65.53,22.35 64.01,20.83 64.01,18.03 MOTORTREIBER1.4
CCW2
  Bottom 0.61: MOTORTREIBER2.3 8.38,41.15 5.59,38.35 5.59,25.4 29.21,2.03 87.63,2.03 101.09,15.24 OK1.15
CCW2-
  Bottom 0.406: CCW2-.2 22.86,37.34 21.84,38.35 16.26,38.35 14.48,40.13 14.48,41.4 MOTORTREIBER2.4
CCW3
  Bottom 0.61: MOTORTREIBER3.3 42.42,88.93 43.15,89.66 67.08,89.66 76.09,80.65 76.09,65.81 87.25,54.65 107.4,54.65 OK2.11
CCW3-
  Bottom 0.406: CCW3-1.2 37.85,76.71 39.37,78.23 39.37,83.06 41.4,85.09 42.67,85.09 MOTORTREIBER3.4
CW1
  Bottom 0.61: MOTORTREIBER1.1 72.9,12.45 88.39,27.94 OK1.10
CW1-
  Bottom 0.305: 71.88,22.35 CW1-.2
  Bottom 0.406: 71.88,22.35 70.61,21.08 70.61,16.51 69.09,14.99 66.04,14.99 MOTORTREIBER1.2
CW2
  Bottom 0.61: MOTORTREIBER2.1 12.19,28.19 35.31,5.08 84.58,5.08 97.28,17.78 OK1.14
CW2-
  Bottom 0.406: CW2-.2 22.86,31.24 21.59,32.51 16.26,32.51 14.48,34.29 14.48,36.32 MOTORTREIBER2.2
CW3
  Bottom 0.61: MOTORTREIBER3.1 37.34,88.75 39.47,90.88 68.26,90.88 77.81,81.33 77.81,67.11 87.75,57.17 107.42,57.17 OK2.10
CW3-
  Bottom 0.406: CW3-.2 31.5,76.71 33.02,78.23 33.02,83.57 34.8,85.34 37.85,85.34 MOTORTREIBER3.2
DIR
  Bottom 1.016: R27.1 U$1.DIR
  Bottom 1.27: U$1.DIR 71.53,65.79 90.3,47.02 107.41,47.02 OK2.14
GNDLAPTOP
  pour Bottom: 113.28,0 160.02,0 160.02,100.33 113.28,99.82
  pour Top: 160.02,0 113.03,0 113.03,100.08 160.02,100.08
GNDROBOTER
  pour Bottom: 108.97,0 109.22,100.33 0,100.33 0,-0.42
  pour Top: 0,0 109.47,0 109.47,100.08 0,100.08
IN1
  Bottom 1.27: U$3.4 105.29,88.51 OK3.1
IN2
  Bottom 1.27: U$3.3 93.71,85.14 100.11,78.74 OK3.4
IN3
  Bottom 1.27: U$3.2 88.63,82.99 95.42,76.2 OK3.5
INL1
  Bottom 1.016: OK3.15 118.11,83.82 135.79,66.14 X2.13
INL2
  Bottom 1.016: OK3.14 116.84,81.28 134.75,63.37 X2.12
INL3
  Bottom 1.016: OK3.11 120.65,73.66 133.71,60.6 X2.11
INL4
  Bottom 1.016: OK3.10 119.38,71.12 132.66,57.84 X2.10
MOTOR1A
  Bottom 2.007: U$2.3 U$1.1A
MOTOR1B
  Bottom 2.007: U$2.4 U$1.1B
MOTOR2A
  Bottom 2.007: U$2.2 U$1.2A
MOTOR2B
  Bottom 2.007: U$2.1 U$1.2B
N$1
  Bottom 1.016: OK1.1 R1.2
N$2
  Bottom 1.016: R3.1 R4.2
N$3
  Bottom 1.27: OK1.4 117.12,20.32 R3.2
N$4
  Bottom 1.016: R5.1 R6.2
N$5
  Bottom 1.016: R1.1 R2.2
N$6
  Bottom 1.27: OK1.5 117.12,22.86 R5.2
N$7
  Bottom 1.016: OK1.8 R7.2
N$8
  Bottom 1.016: R7.1 R8.2
N$9
  Bottom 1.016: OK2.1 R9.2
N$10
  Bottom 1.016: R9.1 R10.2
N$11
  Bottom 1.016: R11.1 R12.2
N$12
  Bottom 1.016: R13.1 R14.2
N$13
  Bottom 1.016: R15.1 R16.2
N$14
  Bottom 1.27: OK2.4 117.12,49.53 R11.2
N$15
  Bottom 1.27: OK2.5 117.12,52.07 R13.2
N$16
  Bottom 1.016: OK2.8 R15.2
N$18
  Bottom 1.27: U$3.1 83.55,78.88 93.88,68.55 107.41,68.55 OK3.8
N$25
  Bottom 1.016: U$1.SLEEP R25.1
  Bottom 2.54: U$1.ENABLE U$1.MS1 U$1.MS2 U$1.MS3 U$1.RESET U$1.SLEEP
OUT1
  Bottom 1.016: X2.2 148.95,35.69 R2.1
OUT2
  Bottom 1.016: R4.1 145.37,38.46 X2.3
OUT3
  Bottom 1.016: R6.1 143.05,41.22 X2.4
OUT4
  Bottom 1.016: R8.1 139.47,43.99 X2.5
OUT5
  Bottom 1.016: R10.1 130.81,46.76 X2.6
OUT6
  Bottom 1.016: R12.1 127.23,49.53 X2.7
OUT7
  Bottom 1.016: R14.1 127,52.3 X2.8
OUT8
  Bottom 1.016: R16.1 130.58,55.07 X2.9
STEP
  Bottom 1.016: R26.1 U$1.STEP
  Bottom 1.27: OK2.15 82.07,44.45 74.34,52.18 74.34,59.67 70.81,63.2 69.38,63.2 U$1.STEP